# Altium schematic sheet PB_Conn.SchDoc
size A4; SheetNumber: 11; SheetTotal: 13
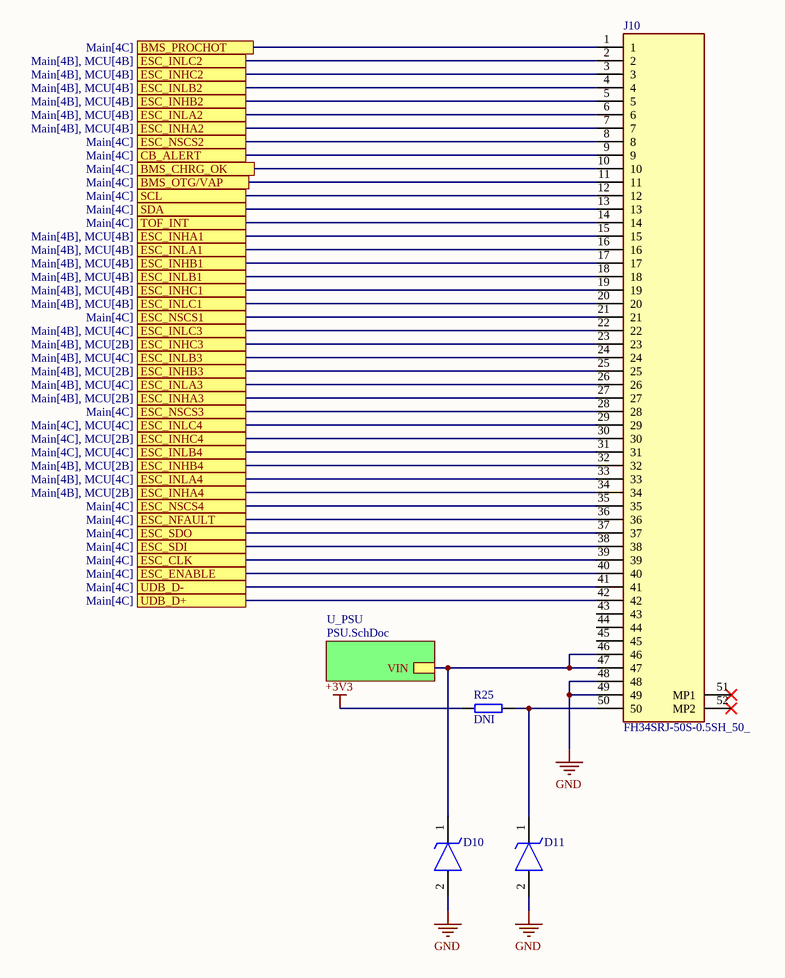
[diagram p0: PB_Conn.SchDoc]

## Parts
D10  DF2S24FS,L3M  [SODFL1006X45N]  (value not drawn)
D11  DF2S24FS,L3M  [SODFL1006X45N]  (value not drawn)
J10  FH34SRJ-50S-0.5SH_50_  [FH34SRJ50S05SH50]
R25  value DNI  [RES0402]  (hidden comment: Res0402)

## Sub-sheets
U_PSU = PSU.SchDoc: VIN

## Ports
BMS_CHRG_OK (see Main[4C]), BMS_OTG/VAP (see Main[4C]), BMS_PROCHOT (see Main[4C]), CB_ALERT (see Main[4C]), ESC_CLK (see Main[4C]), ESC_ENABLE (see Main[4C]), ESC_INHA1 (see Main[4B], MCU[4B]), ESC_INHA2 (see Main[4B], MCU[4B]), ESC_INHA3 (see Main[4B], MCU[2B]), ESC_INHA4 (see Main[4B], MCU[2B]), ESC_INHB1 (see Main[4B], MCU[4B]), ESC_INHB2 (see Main[4B], MCU[4B]), ESC_INHB3 (see Main[4B], MCU[2B]), ESC_INHB4 (see Main[4B], MCU[2B]), ESC_INHC1 (see Main[4B], MCU[4B]), ESC_INHC2 (see Main[4B], MCU[4B]), ESC_INHC3 (see Main[4B], MCU[2B]), ESC_INHC4 (see Main[4C], MCU[2B]), ESC_INLA1 (see Main[4B], MCU[4B]), ESC_INLA2 (see Main[4B], MCU[4B]), ESC_INLA3 (see Main[4B], MCU[4C]), ESC_INLA4 (see Main[4B], MCU[4C]), ESC_INLB1 (see Main[4B], MCU[4B]), ESC_INLB2 (see Main[4B], MCU[4B]), ESC_INLB3 (see Main[4B], MCU[4C]), ESC_INLB4 (see Main[4C], MCU[4C]), ESC_INLC1 (see Main[4B], MCU[4B]), ESC_INLC2 (see Main[4B], MCU[4B]), ESC_INLC3 (see Main[4B], MCU[4C]), ESC_INLC4 (see Main[4C], MCU[4C]), ESC_NFAULT (see Main[4C]), ESC_NSCS1 (see Main[4C]), ESC_NSCS2 (see Main[4C]), ESC_NSCS3 (see Main[4C]), ESC_NSCS4 (see Main[4C]), ESC_SDI (see Main[4C]), ESC_SDO (see Main[4C]), SCL (see Main[4C]), SDA (see Main[4C]), TOF_INT (see Main[4C]), UDB_D+ (see Main[4C]), UDB_D- (see Main[4C])

## Nets
+3V3: R25.2
GND: D10.2(A) D11.2(A) J10.48 J10.49
BMS_CHRG_OK: J10.10 ; port BMS_CHRG_OK
BMS_OTG/VAP: J10.11 ; port BMS_OTG/VAP
BMS_PROCHOT: J10.1 ; port BMS_PROCHOT
CB_ALERT: J10.9 ; port CB_ALERT
ESC_CLK: J10.39 ; port ESC_CLK
ESC_ENABLE: J10.40 ; port ESC_ENABLE
ESC_INHA1: J10.15 ; port ESC_INHA1
ESC_INHA2: J10.7 ; port ESC_INHA2
ESC_INHA3: J10.27 ; port ESC_INHA3
ESC_INHA4: J10.34 ; port ESC_INHA4
ESC_INHB1: J10.17 ; port ESC_INHB1
ESC_INHB2: J10.5 ; port ESC_INHB2
ESC_INHB3: J10.25 ; port ESC_INHB3
ESC_INHB4: J10.32 ; port ESC_INHB4
ESC_INHC1: J10.19 ; port ESC_INHC1
ESC_INHC2: J10.3 ; port ESC_INHC2
ESC_INHC3: J10.23 ; port ESC_INHC3
ESC_INHC4: J10.30 ; port ESC_INHC4
ESC_INLA1: J10.16 ; port ESC_INLA1
ESC_INLA2: J10.6 ; port ESC_INLA2
ESC_INLA3: J10.26 ; port ESC_INLA3
ESC_INLA4: J10.33 ; port ESC_INLA4
ESC_INLB1: J10.18 ; port ESC_INLB1
ESC_INLB2: J10.4 ; port ESC_INLB2
ESC_INLB3: J10.24 ; port ESC_INLB3
ESC_INLB4: J10.31 ; port ESC_INLB4
ESC_INLC1: J10.20 ; port ESC_INLC1
ESC_INLC2: J10.2 ; port ESC_INLC2
ESC_INLC3: J10.22 ; port ESC_INLC3
ESC_INLC4: J10.29 ; port ESC_INLC4
ESC_NFAULT: J10.36 ; port ESC_NFAULT
ESC_NSCS1: J10.21 ; port ESC_NSCS1
ESC_NSCS2: J10.8 ; port ESC_NSCS2
ESC_NSCS3: J10.28 ; port ESC_NSCS3
ESC_NSCS4: J10.35 ; port ESC_NSCS4
ESC_SDI: J10.38 ; port ESC_SDI
ESC_SDO: J10.37 ; port ESC_SDO
SCL: J10.12 ; port SCL
SDA: J10.13 ; port SDA
TOF_INT: J10.14 ; port TOF_INT
UDB_D+: J10.42 ; port UDB_D+
UDB_D-: J10.41 ; port UDB_D-
NetD10_1: D10.1(K) J10.46 J10.47 ; sheet U_PSU/VIN
NetD11_1: D11.1(K) J10.50 R25.1

Not connected (* = marked no-connect by the designer): J10 43 44 45 51(MP1)* 52(MP2)*

## Notes on the sheet
- (near R25) Each ESC can output 30mA, PB schould be able to sustain itself

## Library data of the parts
D10 D11 = DF2S24FS,L3M: TVS Diode (Uni-directional); Manufacturer_Name: Toshiba; Datasheet Link: https://www.mouser.com/datasheet/2/408/DF2S24FS_datasheet_en_20140718-708374.pdf; Height: 0.45mm; Manufacturer_Part_Number: DF2S24FS,L3M; Mouser Part Number: 757-DF2S24FSL3M; Mouser Price/Stock: https://www.mouser.co.uk/ProductDetail/Toshiba/DF2S24FSL3M?qs=lhkzy8lC%252BSvG2umxl0FuEw%3D%3D; Arrow Part Number: DF2S24FS,L3M; Arrow Price/Stock: https://www.arrow.com/en/products/df2s24fsl3m/toshiba?region=nac
J10 = FH34SRJ-50S-0.5SH_50_: Connector; Manufacturer_Name: Hirose; Manufacturer_Part_Number: FH34SRJ-50S-0.5SH(50); Datasheet Link: https://www.hirose.com/en/product/document?clcode=CL0580-1266-2-50&productname=FH34SRJ-50S-0.5SH(50)&series=FH34SRJ&documenttype=2DDrawing&lang=en&documentid=0001483059; Height: 1.75mm; Mouser Part Number: 798-FH34SRJ50S05SH50; Mouser Price/Stock: https://www.mouser.co.uk/ProductDetail/Hirose-Connector/FH34SRJ-50S-0.5SH50?qs=vcbW%252B4%252BSTIrLLD%2F8H%2F%252B%2Fhg%3D%3D; System: Connector